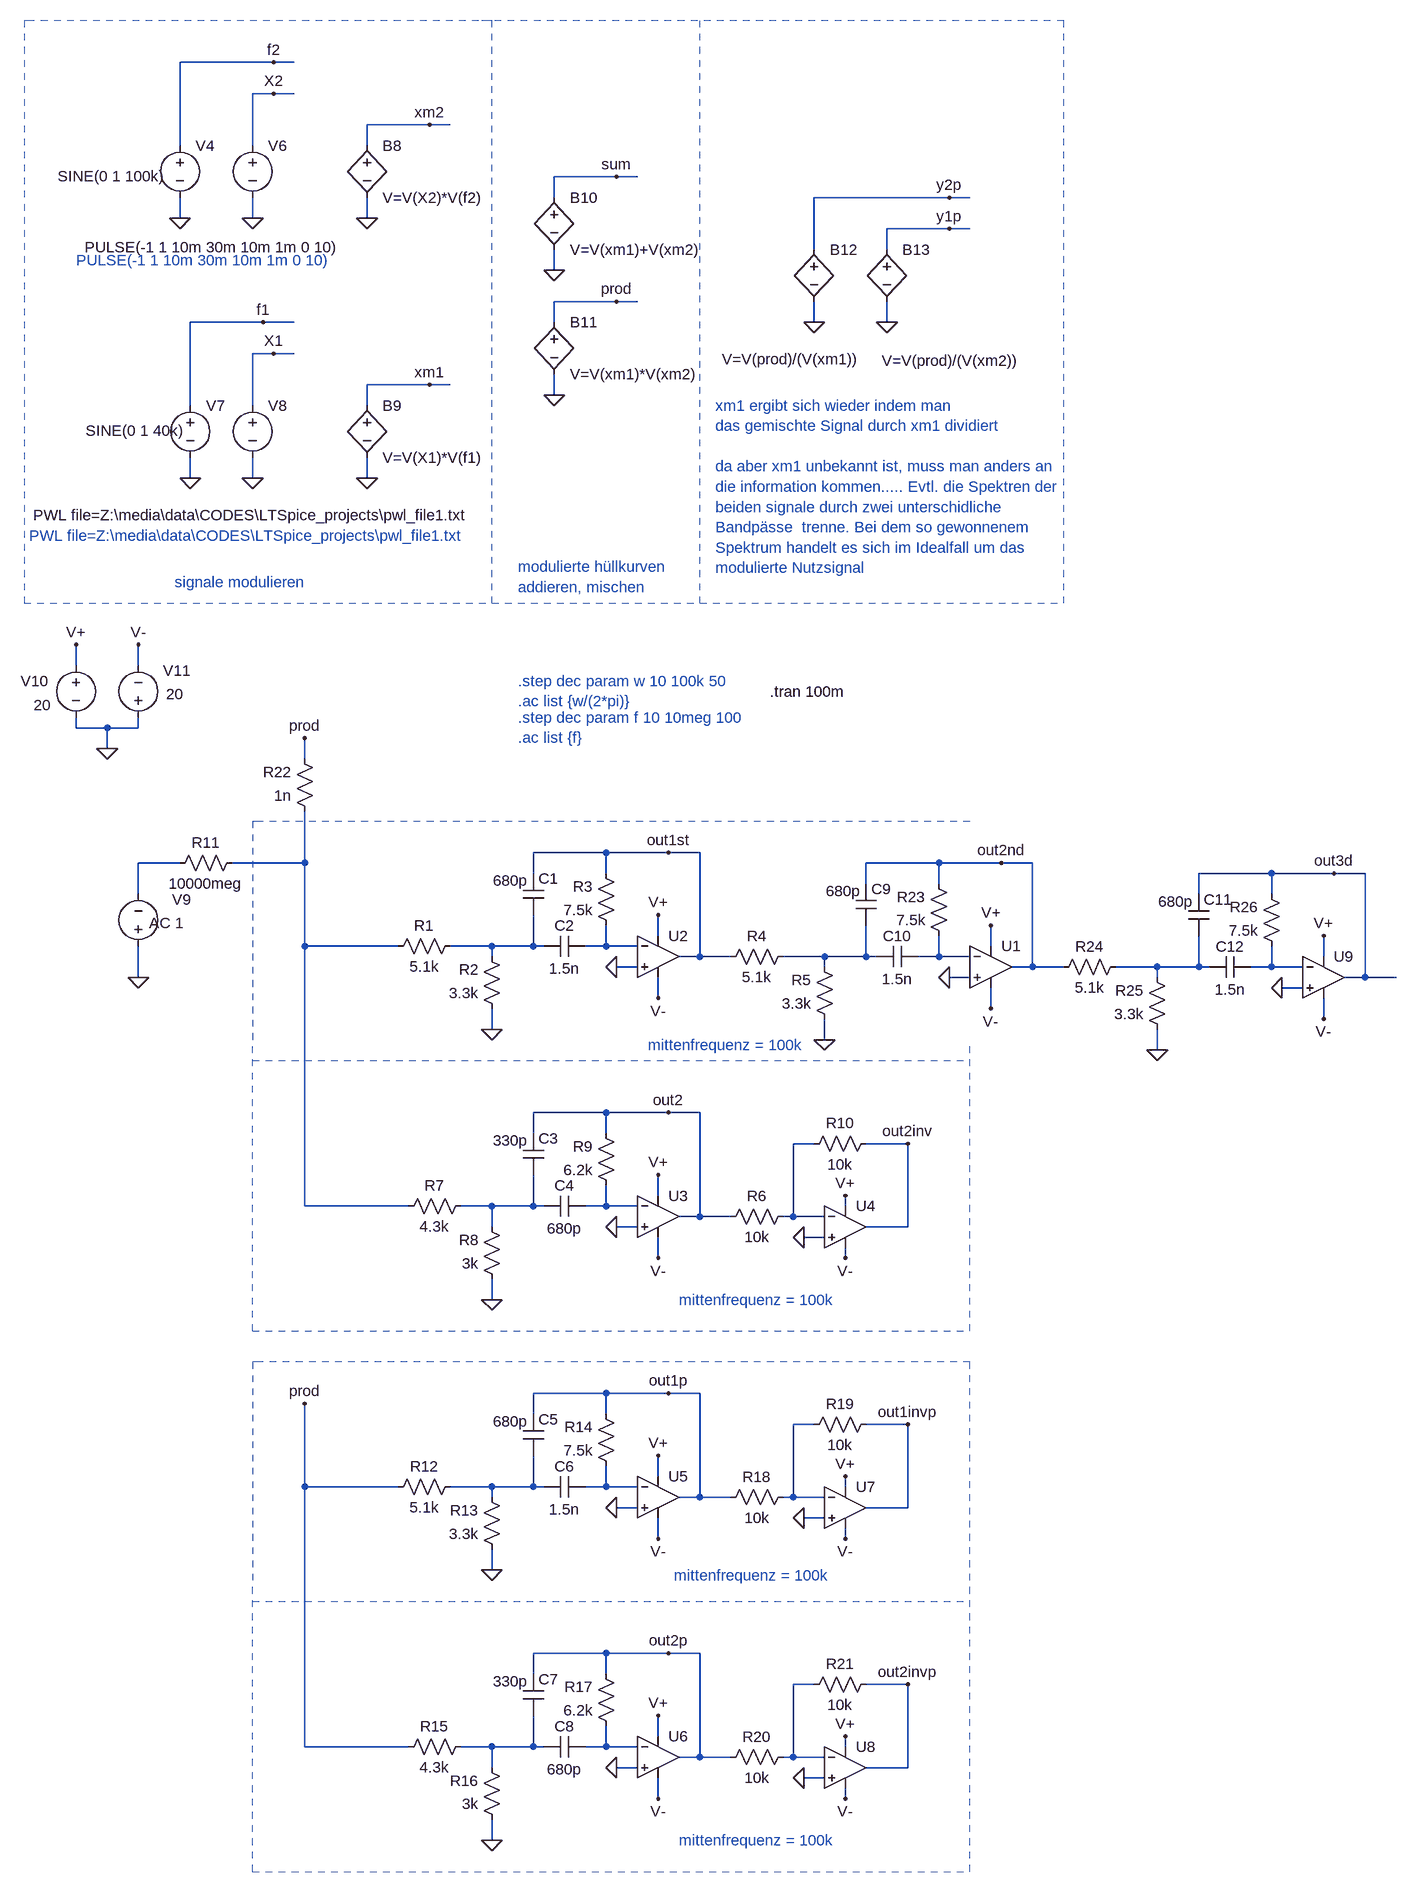
[diagram p0: schematic modulation_bandbreite_laplace.asc]
modulation_bandbreite_laplace.asc, the LTspice schematic file:
Version 4
SHEET 1 1684 2740
WIRE -336 -48 -480 -48
WIRE -304 -48 -336 -48
WIRE -336 0 -368 0
WIRE -304 0 -336 0
WIRE -96 48 -192 48
WIRE -64 48 -96 48
WIRE -480 80 -480 -48
WIRE -368 80 -368 0
WIRE -192 80 -192 48
WIRE 192 128 96 128
WIRE 224 128 192 128
WIRE 96 160 96 128
WIRE 704 160 496 160
WIRE 736 160 704 160
WIRE -480 192 -480 160
WIRE -368 192 -368 160
WIRE -192 192 -192 160
WIRE 704 208 608 208
WIRE 736 208 704 208
WIRE 496 240 496 160
WIRE 608 240 608 208
WIRE 96 272 96 240
WIRE 192 320 96 320
WIRE 224 320 192 320
WIRE -352 352 -464 352
WIRE -304 352 -352 352
WIRE 96 352 96 320
WIRE 496 352 496 320
WIRE 608 352 608 320
WIRE -336 400 -368 400
WIRE -304 400 -336 400
WIRE -96 448 -192 448
WIRE -64 448 -96 448
WIRE 96 464 96 432
WIRE -464 480 -464 352
WIRE -368 480 -368 400
WIRE -192 480 -192 448
WIRE -464 592 -464 560
WIRE -368 592 -368 560
WIRE -192 592 -192 560
WIRE -640 880 -640 848
WIRE -544 880 -544 848
WIRE -640 976 -640 960
WIRE -592 976 -640 976
WIRE -544 976 -544 960
WIRE -544 976 -592 976
WIRE -592 1008 -592 976
WIRE -288 1024 -288 992
WIRE 176 1168 64 1168
WIRE 272 1168 176 1168
WIRE 320 1168 272 1168
WIRE -480 1184 -544 1184
WIRE -288 1184 -288 1104
WIRE -288 1184 -400 1184
WIRE 688 1184 576 1184
WIRE 784 1184 688 1184
WIRE 832 1184 784 1184
WIRE 64 1200 64 1168
WIRE 176 1200 176 1168
WIRE 1200 1200 1088 1200
WIRE 1296 1200 1200 1200
WIRE 1344 1200 1296 1200
WIRE 576 1216 576 1184
WIRE 688 1216 688 1184
WIRE -544 1232 -544 1184
WIRE 1088 1232 1088 1200
WIRE 1200 1232 1200 1200
WIRE 256 1296 256 1264
WIRE -288 1312 -288 1184
WIRE -144 1312 -288 1312
WIRE 0 1312 -64 1312
WIRE 64 1312 64 1264
WIRE 64 1312 0 1312
WIRE 80 1312 64 1312
WIRE 176 1312 176 1280
WIRE 176 1312 144 1312
WIRE 224 1312 176 1312
WIRE 768 1312 768 1280
WIRE 0 1328 0 1312
WIRE 320 1328 320 1168
WIRE 320 1328 288 1328
WIRE 368 1328 320 1328
WIRE 512 1328 448 1328
WIRE 576 1328 576 1280
WIRE 576 1328 512 1328
WIRE 592 1328 576 1328
WIRE 688 1328 688 1296
WIRE 688 1328 656 1328
WIRE 736 1328 688 1328
WIRE 1280 1328 1280 1296
WIRE 224 1344 192 1344
WIRE 512 1344 512 1328
WIRE 832 1344 832 1184
WIRE 832 1344 800 1344
WIRE 880 1344 832 1344
WIRE 1024 1344 960 1344
WIRE 1088 1344 1088 1296
WIRE 1088 1344 1024 1344
WIRE 1104 1344 1088 1344
WIRE 1200 1344 1200 1312
WIRE 1200 1344 1168 1344
WIRE 1248 1344 1200 1344
WIRE -544 1360 -544 1312
WIRE 736 1360 704 1360
WIRE 1024 1360 1024 1344
WIRE 1344 1360 1344 1200
WIRE 1344 1360 1312 1360
WIRE 1392 1360 1344 1360
WIRE 1248 1376 1216 1376
WIRE 256 1392 256 1360
WIRE 768 1408 768 1376
WIRE 1280 1424 1280 1392
WIRE 0 1440 0 1408
WIRE 512 1456 512 1424
WIRE 1024 1472 1024 1440
WIRE 176 1568 64 1568
WIRE 272 1568 176 1568
WIRE 320 1568 272 1568
WIRE 64 1600 64 1568
WIRE 176 1600 176 1568
WIRE 496 1616 464 1616
WIRE 640 1616 576 1616
WIRE 256 1696 256 1664
WIRE -288 1712 -288 1312
WIRE -128 1712 -288 1712
WIRE 0 1712 -48 1712
WIRE 64 1712 64 1664
WIRE 64 1712 0 1712
WIRE 80 1712 64 1712
WIRE 176 1712 176 1680
WIRE 176 1712 144 1712
WIRE 224 1712 176 1712
WIRE 544 1712 544 1696
WIRE 320 1728 320 1568
WIRE 320 1728 288 1728
WIRE 368 1728 320 1728
WIRE 464 1728 464 1616
WIRE 464 1728 448 1728
WIRE 512 1728 464 1728
WIRE 0 1744 0 1712
WIRE 224 1744 192 1744
WIRE 640 1744 640 1616
WIRE 640 1744 576 1744
WIRE 512 1760 480 1760
WIRE 256 1792 256 1760
WIRE 544 1792 544 1776
WIRE 0 1856 0 1824
WIRE 176 2000 64 2000
WIRE 272 2000 176 2000
WIRE 320 2000 272 2000
WIRE 64 2032 64 2000
WIRE 176 2032 176 2000
WIRE 496 2048 464 2048
WIRE 640 2048 576 2048
WIRE 256 2128 256 2096
WIRE -288 2144 -288 2016
WIRE -144 2144 -288 2144
WIRE 0 2144 -64 2144
WIRE 64 2144 64 2096
WIRE 64 2144 0 2144
WIRE 80 2144 64 2144
WIRE 176 2144 176 2112
WIRE 176 2144 144 2144
WIRE 224 2144 176 2144
WIRE 544 2144 544 2128
WIRE 0 2160 0 2144
WIRE 320 2160 320 2000
WIRE 320 2160 288 2160
WIRE 368 2160 320 2160
WIRE 464 2160 464 2048
WIRE 464 2160 448 2160
WIRE 512 2160 464 2160
WIRE 224 2176 192 2176
WIRE 640 2176 640 2048
WIRE 640 2176 576 2176
WIRE 512 2192 480 2192
WIRE 256 2224 256 2192
WIRE 544 2224 544 2208
WIRE 0 2272 0 2240
WIRE 176 2400 64 2400
WIRE 272 2400 176 2400
WIRE 320 2400 272 2400
WIRE 64 2432 64 2400
WIRE 176 2432 176 2400
WIRE 496 2448 464 2448
WIRE 640 2448 576 2448
WIRE 256 2528 256 2496
WIRE -288 2544 -288 2144
WIRE -128 2544 -288 2544
WIRE 0 2544 -48 2544
WIRE 64 2544 64 2496
WIRE 64 2544 0 2544
WIRE 80 2544 64 2544
WIRE 176 2544 176 2512
WIRE 176 2544 144 2544
WIRE 224 2544 176 2544
WIRE 544 2544 544 2528
WIRE 320 2560 320 2400
WIRE 320 2560 288 2560
WIRE 368 2560 320 2560
WIRE 464 2560 464 2448
WIRE 464 2560 448 2560
WIRE 512 2560 464 2560
WIRE 0 2576 0 2544
WIRE 224 2576 192 2576
WIRE 640 2576 640 2448
WIRE 640 2576 576 2576
WIRE 512 2592 480 2592
WIRE 256 2624 256 2592
WIRE 544 2624 544 2608
WIRE 0 2688 0 2656
FLAG -480 192 0
FLAG -368 592 0
FLAG -192 592 0
FLAG -336 400 X1
FLAG -336 -48 f2
FLAG -96 448 xm1
FLAG -464 592 0
FLAG -352 352 f1
FLAG -192 192 0
FLAG -96 48 xm2
FLAG -368 192 0
FLAG -336 0 X2
FLAG 96 272 0
FLAG 192 128 sum
FLAG 96 464 0
FLAG 192 320 prod
FLAG 608 352 0
FLAG 704 208 y1p
FLAG 496 352 0
FLAG 704 160 y2p
FLAG 192 1344 0
FLAG 0 1440 0
FLAG -544 848 V-
FLAG -640 848 V+
FLAG 256 1264 V+
FLAG 256 1392 V-
FLAG 272 1168 out1st
FLAG 192 1744 0
FLAG 0 1856 0
FLAG 256 1664 V+
FLAG 256 1792 V-
FLAG 272 1568 out2
FLAG 544 1696 V+
FLAG 544 1792 V-
FLAG 480 1760 0
FLAG 640 1616 out2inv
FLAG -592 1008 0
FLAG -544 1360 0
FLAG -288 992 prod
FLAG 192 2176 0
FLAG 0 2272 0
FLAG 256 2096 V+
FLAG 256 2224 V-
FLAG 272 2000 out1p
FLAG 192 2576 0
FLAG 0 2688 0
FLAG 256 2496 V+
FLAG 256 2624 V-
FLAG 272 2400 out2p
FLAG 544 2128 V+
FLAG 544 2224 V-
FLAG 480 2192 0
FLAG 544 2528 V+
FLAG 544 2624 V-
FLAG 480 2592 0
FLAG 640 2448 out2invp
FLAG 640 2048 out1invp
FLAG -288 2016 prod
FLAG 704 1360 0
FLAG 512 1456 0
FLAG 768 1280 V+
FLAG 768 1408 V-
FLAG 784 1184 out2nd
FLAG 1216 1376 0
FLAG 1024 1472 0
FLAG 1280 1296 V+
FLAG 1280 1424 V-
FLAG 1296 1200 out3d
SYMBOL voltage -480 64 R0
WINDOW 3 -188 63 Left 2
SYMATTR InstName V4
SYMATTR Value SINE(0 1 100k)
SYMBOL voltage -368 64 R0
WINDOW 3 -259 172 Left 2
WINDOW 123 0 0 Left 2
WINDOW 39 0 0 Left 2
SYMATTR InstName V6
SYMATTR Value PULSE(-1 1 10m 30m 10m 1m 0 10)
SYMBOL voltage -464 464 R0
WINDOW 3 -161 55 Left 2
WINDOW 123 0 0 Left 2
WINDOW 39 0 0 Left 2
SYMATTR InstName V7
SYMATTR Value SINE(0 1 40k)
SYMBOL voltage -368 464 R0
WINDOW 3 -338 185 Left 2
SYMATTR InstName V8
SYMATTR Value PWL file=Z:\media\data\CODES\LTSpice_projects\pwl_file1.txt
SYMBOL bv -192 64 R0
SYMATTR InstName B8
SYMATTR Value V=V(X2)*V(f2)
SYMBOL bv -192 464 R0
SYMATTR InstName B9
SYMATTR Value V=V(X1)*V(f1)
SYMBOL bv 96 144 R0
SYMATTR InstName B10
SYMATTR Value V=V(xm1)+V(xm2)
SYMBOL bv 96 336 R0
SYMATTR InstName B11
SYMATTR Value V=V(xm1)*V(xm2)
SYMBOL bv 496 224 R0
WINDOW 3 -142 185 Left 2
SYMATTR InstName B12
SYMATTR Value V=V(prod)/(V(xm1))
SYMBOL bv 608 224 R0
WINDOW 3 -8 187 Left 2
SYMATTR InstName B13
SYMATTR Value V=V(prod)/(V(xm2))
SYMBOL res -48 1296 R90
WINDOW 0 0 56 VBottom 2
WINDOW 3 32 56 VTop 2
SYMATTR InstName R1
SYMATTR Value 5.1k
SYMBOL res 16 1424 R180
WINDOW 0 36 76 Left 2
WINDOW 3 36 40 Left 2
SYMATTR InstName R2
SYMATTR Value 3.3k
SYMBOL res 192 1296 R180
WINDOW 0 36 76 Left 2
WINDOW 3 36 40 Left 2
SYMATTR InstName R3
SYMATTR Value 7.5k
SYMBOL cap 48 1200 R0
WINDOW 3 -46 11 Left 2
SYMATTR InstName C1
SYMATTR Value 680p
SYMBOL cap 144 1296 R90
WINDOW 0 0 32 VBottom 2
WINDOW 3 35 32 VTop 2
SYMATTR InstName C2
SYMATTR Value 1.5n
SYMBOL voltage -640 864 R0
WINDOW 0 -85 40 Left 2
WINDOW 3 -65 77 Left 2
SYMATTR InstName V10
SYMATTR Value 20
SYMBOL voltage -544 976 R180
WINDOW 0 -81 88 Left 2
WINDOW 3 -70 52 Left 2
SYMATTR InstName V11
SYMATTR Value 20
SYMBOL Opamps\\UniversalOpamp2 256 1328 R0
SYMATTR InstName U2
SYMATTR Value2 Avol=10Meg GBW=100Meg Slew=10Meg
SYMBOL res -32 1696 R90
WINDOW 0 0 56 VBottom 2
WINDOW 3 32 56 VTop 2
SYMATTR InstName R7
SYMATTR Value 4.3k
SYMBOL res 16 1840 R180
WINDOW 0 36 76 Left 2
WINDOW 3 36 40 Left 2
SYMATTR InstName R8
SYMATTR Value 3k
SYMBOL res 192 1696 R180
WINDOW 0 36 76 Left 2
WINDOW 3 36 40 Left 2
SYMATTR InstName R9
SYMATTR Value 6.2k
SYMBOL cap 48 1600 R0
WINDOW 3 -46 11 Left 2
SYMATTR InstName C3
SYMATTR Value 330p
SYMBOL cap 144 1696 R90
WINDOW 0 0 32 VBottom 2
WINDOW 3 35 32 VTop 2
SYMATTR InstName C4
SYMATTR Value 680p
SYMBOL Opamps\\UniversalOpamp2 256 1728 R0
SYMATTR InstName U3
SYMATTR Value2 Avol=10Meg GBW=100Meg Slew=10Meg
SYMBOL Opamps\\UniversalOpamp2 544 1744 R0
SYMATTR InstName U4
SYMATTR Value2 Avol=10Meg GBW=100Meg Slew=10Meg
SYMBOL res 464 1712 R90
WINDOW 0 0 56 VBottom 2
WINDOW 3 32 56 VTop 2
SYMATTR InstName R6
SYMATTR Value 10k
SYMBOL res 592 1600 R90
WINDOW 0 0 56 VBottom 2
WINDOW 3 32 56 VTop 2
SYMATTR InstName R10
SYMATTR Value 10k
SYMBOL voltage -544 1328 R180
WINDOW 0 -81 88 Left 2
WINDOW 3 -70 52 Left 2
WINDOW 123 0 0 Left 2
WINDOW 39 0 0 Left 2
SYMATTR InstName V9
SYMATTR Value AC 1
SYMBOL res -384 1168 R90
WINDOW 0 0 56 VBottom 2
WINDOW 3 32 56 VTop 2
SYMATTR InstName R11
SYMATTR Value 10000meg
SYMBOL res -48 2128 R90
WINDOW 0 0 56 VBottom 2
WINDOW 3 32 56 VTop 2
SYMATTR InstName R12
SYMATTR Value 5.1k
SYMBOL res 16 2256 R180
WINDOW 0 36 76 Left 2
WINDOW 3 36 40 Left 2
SYMATTR InstName R13
SYMATTR Value 3.3k
SYMBOL res 192 2128 R180
WINDOW 0 36 76 Left 2
WINDOW 3 36 40 Left 2
SYMATTR InstName R14
SYMATTR Value 7.5k
SYMBOL cap 48 2032 R0
WINDOW 3 -46 11 Left 2
SYMATTR InstName C5
SYMATTR Value 680p
SYMBOL cap 144 2128 R90
WINDOW 0 0 32 VBottom 2
WINDOW 3 35 32 VTop 2
SYMATTR InstName C6
SYMATTR Value 1.5n
SYMBOL Opamps\\UniversalOpamp2 256 2160 R0
SYMATTR InstName U5
SYMATTR Value2 Avol=10Meg GBW=100Meg Slew=10Meg
SYMBOL res -32 2528 R90
WINDOW 0 0 56 VBottom 2
WINDOW 3 32 56 VTop 2
SYMATTR InstName R15
SYMATTR Value 4.3k
SYMBOL res 16 2672 R180
WINDOW 0 36 76 Left 2
WINDOW 3 36 40 Left 2
SYMATTR InstName R16
SYMATTR Value 3k
SYMBOL res 192 2528 R180
WINDOW 0 36 76 Left 2
WINDOW 3 36 40 Left 2
SYMATTR InstName R17
SYMATTR Value 6.2k
SYMBOL cap 48 2432 R0
WINDOW 3 -46 11 Left 2
SYMATTR InstName C7
SYMATTR Value 330p
SYMBOL cap 144 2528 R90
WINDOW 0 0 32 VBottom 2
WINDOW 3 35 32 VTop 2
SYMATTR InstName C8
SYMATTR Value 680p
SYMBOL Opamps\\UniversalOpamp2 256 2560 R0
SYMATTR InstName U6
SYMATTR Value2 Avol=10Meg GBW=100Meg Slew=10Meg
SYMBOL Opamps\\UniversalOpamp2 544 2176 R0
SYMATTR InstName U7
SYMATTR Value2 Avol=10Meg GBW=100Meg Slew=10Meg
SYMBOL res 464 2144 R90
WINDOW 0 0 56 VBottom 2
WINDOW 3 32 56 VTop 2
SYMATTR InstName R18
SYMATTR Value 10k
SYMBOL res 592 2032 R90
WINDOW 0 0 56 VBottom 2
WINDOW 3 32 56 VTop 2
SYMATTR InstName R19
SYMATTR Value 10k
SYMBOL Opamps\\UniversalOpamp2 544 2576 R0
SYMATTR InstName U8
SYMATTR Value2 Avol=10Meg GBW=100Meg Slew=10Meg
SYMBOL res 464 2544 R90
WINDOW 0 0 56 VBottom 2
WINDOW 3 32 56 VTop 2
SYMATTR InstName R20
SYMATTR Value 10k
SYMBOL res 592 2432 R90
WINDOW 0 0 56 VBottom 2
WINDOW 3 32 56 VTop 2
SYMATTR InstName R21
SYMATTR Value 10k
SYMBOL res -272 1120 R180
WINDOW 0 36 76 Left 2
WINDOW 3 36 40 Left 2
SYMATTR InstName R22
SYMATTR Value 1n
SYMBOL res 464 1312 R90
WINDOW 0 0 56 VBottom 2
WINDOW 3 32 56 VTop 2
SYMATTR InstName R4
SYMATTR Value 5.1k
SYMBOL res 528 1440 R180
WINDOW 0 36 76 Left 2
WINDOW 3 36 40 Left 2
SYMATTR InstName R5
SYMATTR Value 3.3k
SYMBOL res 704 1312 R180
WINDOW 0 36 76 Left 2
WINDOW 3 36 40 Left 2
SYMATTR InstName R23
SYMATTR Value 7.5k
SYMBOL cap 560 1216 R0
WINDOW 3 -46 11 Left 2
SYMATTR InstName C9
SYMATTR Value 680p
SYMBOL cap 656 1312 R90
WINDOW 0 0 32 VBottom 2
WINDOW 3 35 32 VTop 2
SYMATTR InstName C10
SYMATTR Value 1.5n
SYMBOL Opamps\\UniversalOpamp2 768 1344 R0
SYMATTR InstName U1
SYMATTR Value2 Avol=10Meg GBW=100Meg Slew=10Meg
SYMBOL res 976 1328 R90
WINDOW 0 0 56 VBottom 2
WINDOW 3 32 56 VTop 2
SYMATTR InstName R24
SYMATTR Value 5.1k
SYMBOL res 1040 1456 R180
WINDOW 0 36 76 Left 2
WINDOW 3 36 40 Left 2
SYMATTR InstName R25
SYMATTR Value 3.3k
SYMBOL res 1216 1328 R180
WINDOW 0 36 76 Left 2
WINDOW 3 36 40 Left 2
SYMATTR InstName R26
SYMATTR Value 7.5k
SYMBOL cap 1072 1232 R0
WINDOW 3 -46 11 Left 2
SYMATTR InstName C11
SYMATTR Value 680p
SYMBOL cap 1168 1328 R90
WINDOW 0 0 32 VBottom 2
WINDOW 3 35 32 VTop 2
SYMATTR InstName C12
SYMATTR Value 1.5n
SYMBOL Opamps\\UniversalOpamp2 1280 1360 R0
SYMATTR InstName U9
SYMATTR Value2 Avol=10Meg GBW=100Meg Slew=10Meg
TEXT -488 752 Left 2 ;signale modulieren
TEXT 40 728 Left 2 ;modulierte hüllkurven \naddieren, mischen
TEXT 344 480 Left 2 ;xm1 ergibt sich wieder indem man\ndas gemischte Signal durch xm1 dividiert\n \nda aber xm1 unbekannt ist, muss man anders an \ndie information kommen..... Evtl. die Spektren der\nbeiden signale durch zwei unterschidliche \nBandpässe  trenne. Bei dem so gewonnenem \nSpektrum handelt es sich im Idealfall um das\nmodulierte Nutzsignal
TEXT 40 904 Left 2 ;.step dec param w 10 100k 50\n.ac list {w/(2*pi)}
TEXT 428 920 Left 2 !.tran 100m
TEXT 40 960 Left 2 ;.step dec param f 10 10meg 100\n.ac list {f}
TEXT 288 1856 Left 2 ;mittenfrequenz = 100k
TEXT 240 1464 Left 2 ;mittenfrequenz = 100k
TEXT 288 2688 Left 2 ;mittenfrequenz = 100k
TEXT 280 2280 Left 2 ;mittenfrequenz = 100k
TEXT -640 256 Left 2 ;PULSE(-1 1 10m 30m 10m 1m 0 10)
TEXT -712 680 Left 2 ;PWL file=Z:\\media\\data\\CODES\\LTSpice_projects\\pwl_file1.txt
LINE Normal 0 -112 -704 -112 2
LINE Normal 0 784 0 -112 2
LINE Normal -720 784 0 784 2
LINE Normal -720 -112 -720 784 2
LINE Normal -704 -112 -720 -112 2
LINE Normal 320 784 320 -112 2
LINE Normal 880 784 880 -112 2
LINE Normal 880 -112 -16 -112 2
LINE Normal -720 784 0 784 2
LINE Normal 0 784 880 784 2
LINE Normal 736 1120 -352 1120 2
LINE Normal -368 1488 736 1488 2
LINE Normal -368 1120 -368 1456 2
LINE Normal -352 1120 -368 1120 2
LINE Normal -368 1904 736 1904 2
LINE Normal 736 1904 736 1456 2
LINE Normal -368 1904 -368 1456 2
LINE Normal 736 1952 -352 1952 2
LINE Normal 736 2288 736 1952 2
LINE Normal -368 2320 736 2320 2
LINE Normal -368 1952 -368 2288 2
LINE Normal -352 1952 -368 1952 2
LINE Normal -368 2736 736 2736 2
LINE Normal 736 2736 736 2288 2
LINE Normal -368 2736 -368 2288 2

The netlist it stands for:
* modulation_bandbreite_laplace.asc
V4 f2 0 SINE(0 1 100k)
V6 X2 0 PULSE(-1 1 10m 30m 10m 1m 0 10)
V7 f1 0 SINE(0 1 40k)
V8 X1 0 PWL file=Z:\media\data\CODES\LTSpice_projects\pwl_file1.txt
B8 xm2 0 V=V(X2)*V(f2)
B9 xm1 0 V=V(X1)*V(f1)
B10 sum 0 V=V(xm1)+V(xm2)
B11 prod 0 V=V(xm1)*V(xm2)
B12 y2p 0 V=V(prod)/(V(xm1))
B13 y1p 0 V=V(prod)/(V(xm2))
R1 N003 N002 5.1k
R2 0 N003 3.3k
R3 N004 out1st 7.5k
C1 out1st N003 680p
C2 N004 N003 1.5n
V10 V+ 0 20
V11 0 V- 20
XU2 0 N004 V+ V- out1st level.2 Avol=10Meg GBW=100Meg Slew=10Meg ilimit=25m rail=0 Vos=0 phimargin=45 en=0 enk=0 in=0 ink=0 Rin=500Meg  ; pins IN+ IN- V+ V- OUT
R7 N010 N002 4.3k
R8 0 N010 3k
R9 N011 out2 6.2k
C3 out2 N010 330p
C4 N011 N010 680p
XU3 0 N011 V+ V- out2 level.2 Avol=10Meg GBW=100Meg Slew=10Meg ilimit=25m rail=0 Vos=0 phimargin=45 en=0 enk=0 in=0 ink=0 Rin=500Meg  ; pins IN+ IN- V+ V- OUT
XU4 0 N009 V+ V- out2inv level.2 Avol=10Meg GBW=100Meg Slew=10Meg ilimit=25m rail=0 Vos=0 phimargin=45 en=0 enk=0 in=0 ink=0 Rin=500Meg  ; pins IN+ IN- V+ V- OUT
R6 N009 out2 10k
R10 out2inv N009 10k
V9 0 N001 AC 1
R11 N002 N001 10000meg
R12 N013 prod 5.1k
R13 0 N013 3.3k
R14 N014 out1p 7.5k
C5 out1p N013 680p
C6 N014 N013 1.5n
XU5 0 N014 V+ V- out1p level.2 Avol=10Meg GBW=100Meg Slew=10Meg ilimit=25m rail=0 Vos=0 phimargin=45 en=0 enk=0 in=0 ink=0 Rin=500Meg  ; pins IN+ IN- V+ V- OUT
R15 N016 prod 4.3k
R16 0 N016 3k
R17 N017 out2p 6.2k
C7 out2p N016 330p
C8 N017 N016 680p
XU6 0 N017 V+ V- out2p level.2 Avol=10Meg GBW=100Meg Slew=10Meg ilimit=25m rail=0 Vos=0 phimargin=45 en=0 enk=0 in=0 ink=0 Rin=500Meg  ; pins IN+ IN- V+ V- OUT
XU7 0 N012 V+ V- out1invp level.2 Avol=10Meg GBW=100Meg Slew=10Meg ilimit=25m rail=0 Vos=0 phimargin=45 en=0 enk=0 in=0 ink=0 Rin=500Meg  ; pins IN+ IN- V+ V- OUT
R18 N012 out1p 10k
R19 out1invp N012 10k
XU8 0 N015 V+ V- out2invp level.2 Avol=10Meg GBW=100Meg Slew=10Meg ilimit=25m rail=0 Vos=0 phimargin=45 en=0 enk=0 in=0 ink=0 Rin=500Meg  ; pins IN+ IN- V+ V- OUT
R20 N015 out2p 10k
R21 out2invp N015 10k
R22 N002 prod 1n
R4 N005 out1st 5.1k
R5 0 N005 3.3k
R23 N006 out2nd 7.5k
C9 out2nd N005 680p
C10 N006 N005 1.5n
XU1 0 N006 V+ V- out2nd level.2 Avol=10Meg GBW=100Meg Slew=10Meg ilimit=25m rail=0 Vos=0 phimargin=45 en=0 enk=0 in=0 ink=0 Rin=500Meg  ; pins IN+ IN- V+ V- OUT
R24 N007 out2nd 5.1k
R25 0 N007 3.3k
R26 N008 out3d 7.5k
C11 out3d N007 680p
C12 N008 N007 1.5n
XU9 0 N008 V+ V- out3d level.2 Avol=10Meg GBW=100Meg Slew=10Meg ilimit=25m rail=0 Vos=0 phimargin=45 en=0 enk=0 in=0 ink=0 Rin=500Meg  ; pins IN+ IN- V+ V- OUT
* signale modulieren
* modulierte hüllkurven
* addieren, mischen
* xm1 ergibt sich wieder indem man
* das gemischte Signal durch xm1 dividiert
* da aber xm1 unbekannt ist, muss man anders an
* die information kommen..... Evtl. die Spektren der
* beiden signale durch zwei unterschidliche
* Bandpässe  trenne. Bei dem so gewonnenem
* Spektrum handelt es sich im Idealfall um das
* modulierte Nutzsignal
* .step dec param w 10 100k 50
* .ac list {w/(2*pi)}
.tran 100m
* .step dec param f 10 10meg 100
* .ac list {f}
* mittenfrequenz = 100k
* mittenfrequenz = 100k
* mittenfrequenz = 100k
* mittenfrequenz = 100k
* PULSE(-1 1 10m 30m 10m 1m 0 10)
* PWL file=Z:\media\data\CODES\LTSpice_projects\pwl_file1.txt
.lib UniversalOpamps2.sub
.backanno
.end